# Altium schematic sheet RPI Hat ID.SchDoc
size A4
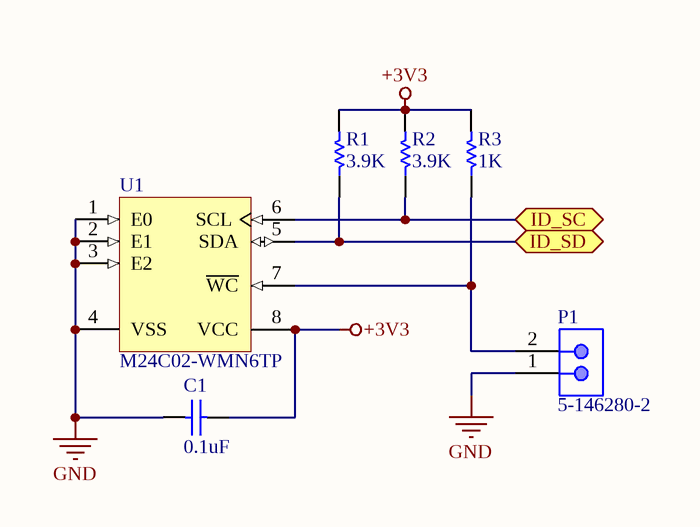
[diagram p0: RPI Hat ID.SchDoc]

## Parts
C1  0.1uF  [CAPC1608X87X35NL15T15]
P1  5-146280-2  [TECO-5-146280-2_V]
R1  3.9K  [RESC1608X55X30ML15T15]
R2  3.9K  [RESC1608X55X30ML15T15]
R3  1K  [RESC1608X55X30ML15T15]
U1  M24C02-WMN6TP  [STM-M24C02-WMN6TP-8_M]

## Ports
ID_SC (bidir), ID_SD (bidir)

## Nets
+3V3: C1.1 R1.2 R2.2 R3.2 U1.8(VCC)
GND: C1.2 P1.1 U1.1(E0) U1.2(E1) U1.3(E2) U1.4(VSS)
ID_SC: R2.1 U1.6(SCL) ; port ID_SC
ID_SD: R1.1 U1.5(SDA) ; port ID_SD
NetP1_2: P1.2 R3.1 U1.7(~{WC})

## Library data of the parts
C1 = CMP-2006-03300-1: Part Number: C0603X104K5RACTU; Manufacturer: Kemet
P1 = CMP-2000-07492-1: Male Header, Pitch 2.54 mm, 1 x 2 Position, Height 8.21 mm, Tail Length 3.05 mm, -65 to 105 degC, RoHS, Bulk; Manufacturer: TE Connectivity; Mating Connector Lock: No(Without); Number of Positions: 2; Pitch: 2.54mm; PCB Mounting Orientation: Vertical; Keyed: No; Case\/Package: 100; Mating Post Length: 0.23inch; High Temperature Housing: Yes; Max Current Rating: 5A; PCB Thickness: 0.063inch; PCB Mount Retention: Without; Approvals: CSA; Current Rating: 3A; Radiation Hardening: No; Length: 4.67mm; Contact Mating Length: 0.23inch; Connector Type: Header; Number of Rows: 1; Termination Post Length: 0.12inch; Board Standoff: No(Without); Max Operating Temperature: 105degC; Contact Shape: Square; Selectively Loaded: No(Without); Gasket: No(Without); Number of Contacts: 2; Contact Gender: Male; Mating Alignment: No(Without); Manufacturer URL: http://www.te.com/; Datasheet URL: http://www.te.com/commerce/DocumentDelivery/DDEController?Action=showdoc&DocId=Customer+Drawing%7F146280%7FH1%7Fpdf%7FEnglish%7FENG_CD_146280_H1.pdf%7F5-146280-2; Mount: ThroughHole; Orientation: Straight; Packaging: Carton; Package Reference: 5-146280-2; Package Quantity: 500; Stabilizers: No(Without); Row Spacing: 2.54mm; Contact Material: CopperAlloy; Panel Mount Retention: No(Without); Datasheet Version: Rev. H1, 08/2016; Housing Colour: Black; Colour: Black; Package Description: Male Header, Pitch 2.54 mm, 1 x 2 Position, Height 8.21 mm, Tail Length 3.05 mm; Contact Plating: Matte; Housing Material: Polymer; Contact Protection: No(Without); Min Operating Temperature: -65degC; Mounting Technology: ThroughHole; Flammability Rating: UL94V-0; RoHSCompliant: true; Termination: ThroughHole; Depth: 2.34mm; High Speed Serial Data Connector: No
R1-R3 = CMP-2000-00180-1: Part Number: ERJ-3EKF1001V; Manufacturer: Panasonic
U1 = CMP-2000-05370-1: EEPROM Serial-I2C, 2Kbit, 2.5 to 5.5 V, 400 kHz, 8-Pin SO, -40 to 85 degC, RoHS, Tape and Reel; Manufacturer: STMicroelectronics; Supply Current: 2mA; Frequency: 0.4MHz; Data Retention: 40; Density: 2048Bit; Rad Hardened: No; Write Protection: Yes; Interface Type: Serial(I2C); DELETED: Compliant; Access Time (Max): 900ns; Operating Supply Voltage (Typ): 3.3/5V; Operating Supply Voltage (Max): 5.5V; Organization: 256x8; Operating Supply Voltage (Min): 2.5V; Operating Temperature (Max): 85C; Operating Temperature Classification: Industrial; Operating Temp Range: -40Cto85C; Frequency (Max): 0.4MHz; Datasheet URL: https://datasheet.ciiva.com/26870/m24c02-wmn6tp-26870257.pdf; Package Type: SOICN; Operating Temperature (Min): -40C; Programmable: Yes; Manufacturer URL: http://www.st.com/; Pin Count: 8; Packaging: TapeandReel; Mounting: SurfaceMount; Datasheet Version: Rev. 17, 04/2011